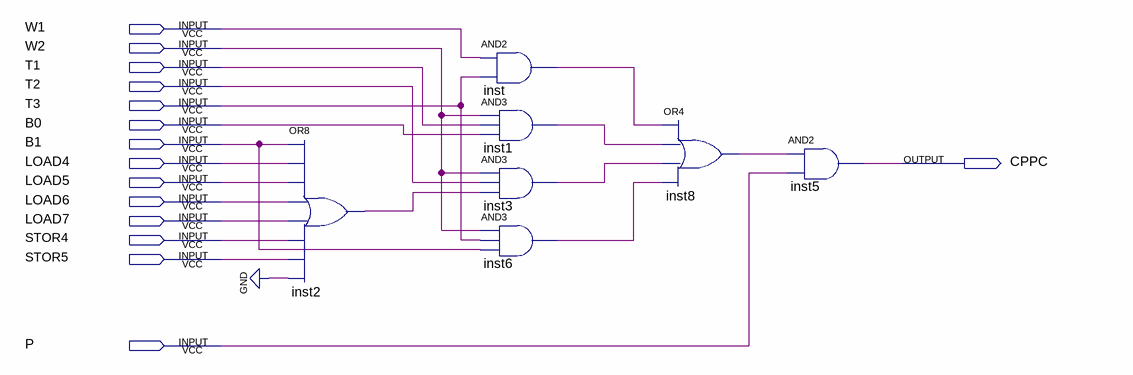
[diagram p0: schematic sheet]
// Quartus schematic CPPC.bdf as structural Verilog: 7 symbols, 15 pins
module CPPC (
  input  W1,
  input  W2,
  input  T1,
  input  T2,
  input  T3,
  input  B0,
  input  B1,
  input  LOAD4,
  input  LOAD5,
  input  LOAD6,
  input  LOAD7,
  input  STOR4,
  input  STOR5,
  input  P,
  output CPPC
);

  wire inst1_out, inst2_out, inst3_out, inst6_out, inst8_out, inst_out;

  or inst2 (inst2_out, B1, LOAD4, LOAD5, LOAD6, LOAD7, STOR4, STOR5, 1'b0);
  and inst (inst_out, W1, T3);
  and inst1 (inst1_out, W2, T1, B0);
  and inst3 (inst3_out, W2, T2, inst2_out);
  and inst6 (inst6_out, W2, T3, B1);
  or inst8 (inst8_out, inst_out, inst1_out, inst3_out, inst6_out);
  and inst5 (CPPC, inst8_out, P);
endmodule
